# EasyEDA schematic SCH_SimpleFOC-StepMini_2024-05-25.json
TITLE: StepMini; REV: 1.0; Date: 2024-04-26; Sheet: 1/1; Drawn By: the.skuric; Company: SimpleFOC
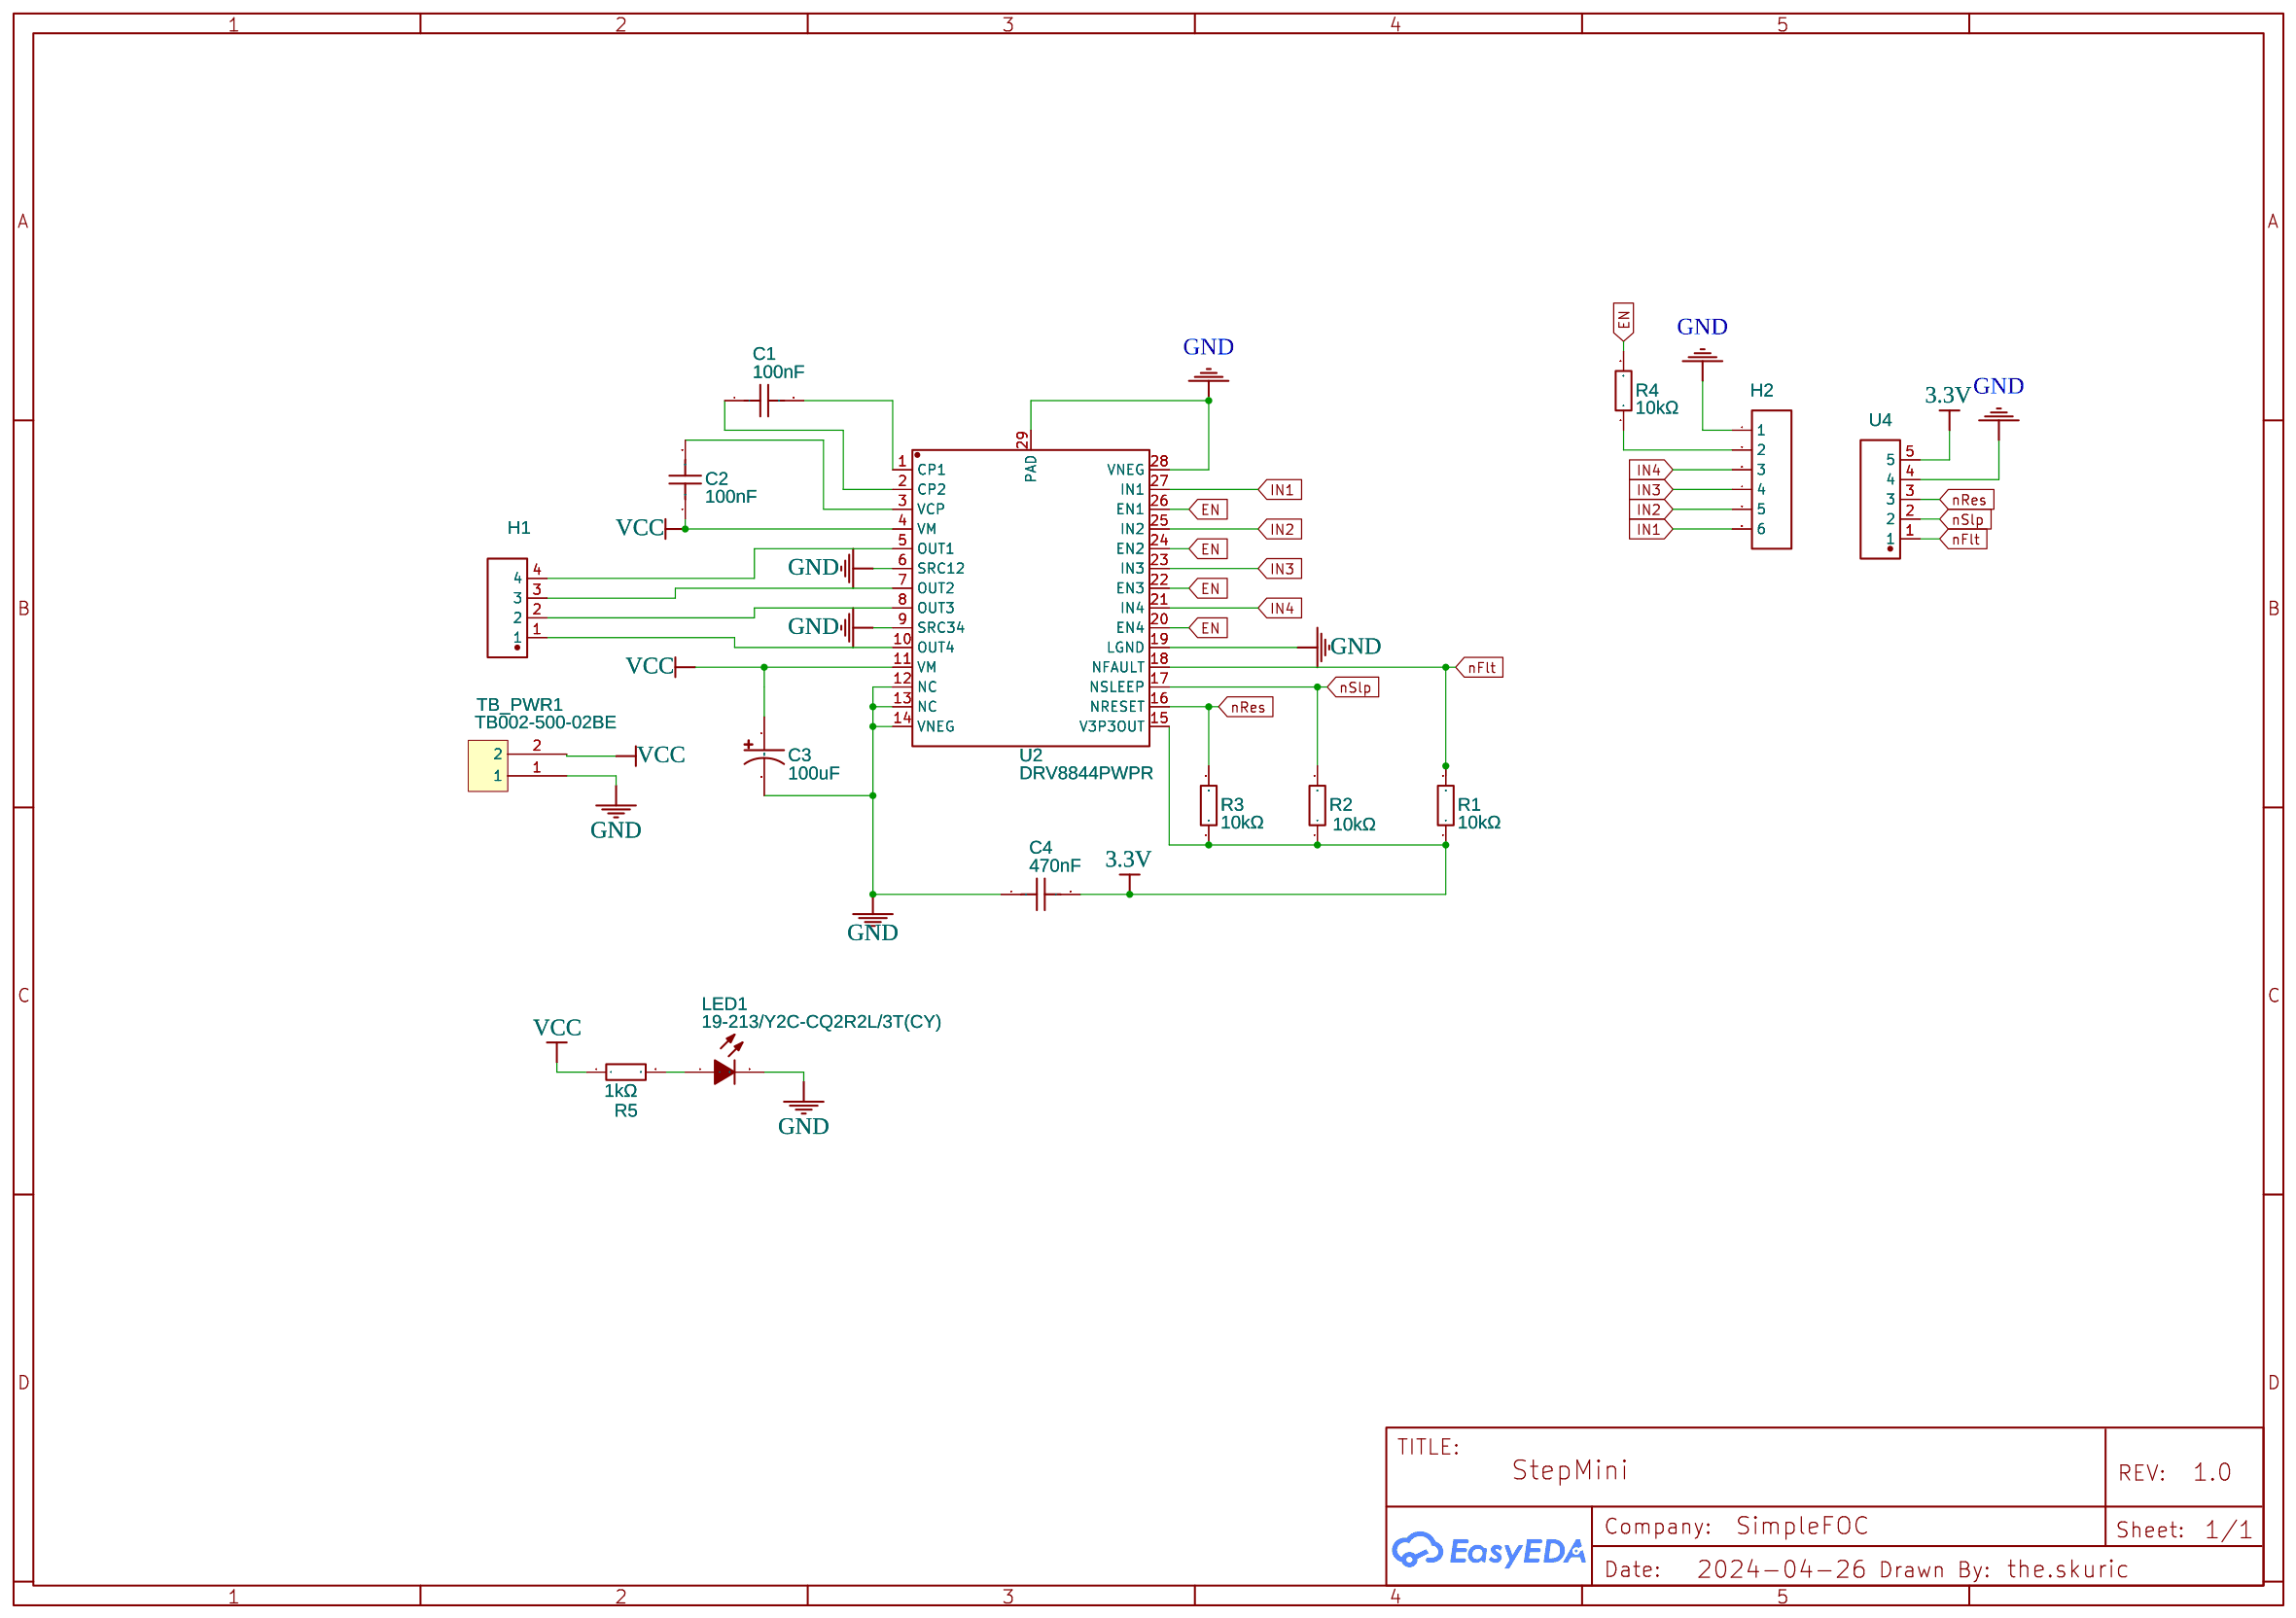
[diagram p0: schematic sheet]

## Parts
C1  100nF  [C0603]
C2  100nF  [C0603]
C3  100uF  [CAP-SMD_BD6.3-L6.6-W6.6-FD]
C4  470nF  [C0603]
H1  KH-2.54PH180-1X4P-L11.5  [HDR-TH_4P-P2.54-V-M]
H2  Header-Male-2.54_1x6  [HDR-TH_6P-P2.54-V-M-1]
LED1  19-213/Y2C-CQ2R2L/3T(CY)  [LED0603-R-RD]
R1  10kΩ  [R0603]
R2  10kΩ  [R0603]
R3  10kΩ  [R0603]
R4  10kΩ  [R0603]
R5  1kΩ  [R0603]
TB_PWR1  TB002-500-02BE  [TB002-500-02BE]
U2  DRV8844PWPR  [HTSSOP-28_L9.8-W4.5-P0.65-LS6.6-BL-EP]
U4  KH-2.54FH-1X5P-H8.5  [HDR-TH_5P-P2.54-V-F]

## Library data of the parts
C1 C2 = CL10B104KB8NNNC: Supplier: LCSC; Manufacturer: SAMSUNG; Supplier Part: C1591
C3 = VT1V101M-CRE77: Supplier: LCSC; Supplier Part: C294520; Manufacturer: Vertical Technology; Contributor: LCSC
C4 = CC0603ZRY5V6BB474: Supplier: LCSC; Supplier Part: C327269; Manufacturer: YAGEO; Contributor: LCSC
H1 = KH-2.54PH180-1X4P-L11.5: Contributor: LCSC; Supplier: LCSC; Supplier Part: C2905435; Manufacturer: kinghelm(金航标); JLCPCB Part Class: Extended Part
H2 = Header-Male-2.54_1x6: Supplier: LCSC; Manufacturer: BOOMELE(博穆精密); Manufacturer Part: 2.54-1x6P直针; Supplier Part: C37208; JLCPCB Part Class: Extended Part
LED1 = 19-213/Y2C-CQ2R2L/3T(CY): Supplier: LCSC; Manufacturer: EVERLIGHT; Supplier Part: C72038; JLCPCB Part Class: Basic Part
R1-R5 = 0603WAF4701T5E: Supplier: LCSC; Manufacturer: UniOhm; Supplier Part: C23162; Resistance (Ohms): 4.7K; JLCPCB Part Class: Basic Part
TB_PWR1 = TB002-500-02BE: Supplier 1: Mouser; Supplier Part Number 1: 490-TB002-500-02BE; Contributor: the.skuric
U2 = DRV8844PWPR: Contributor: LCSC; Supplier: LCSC; Supplier Part: C177807; Manufacturer: TI(德州仪器); JLCPCB Part Class: Extended Part
U4 = KH-2.54FH-1X5P-H8.5: Contributor: LCSC; Supplier: LCSC; Supplier Part: C2932671; Manufacturer: kinghelm(金航标)

## Nets
3.3V: C4.2 R1.1 R2.1 R3.1 U2.15(V3P3OUT) U4.5
GND: C3.2 C4.1 H2.1 LED1.2(C) TB_PWR1.1 U2.6(SRC12) U2.9(SRC34) U2.12(NC) U2.13(NC) U2.14(VNEG) U2.19(LGND) U2.28(VNEG) U2.29(PAD) U4.4
VCC: C2.1 C3.1 R5.1 TB_PWR1.2 U2.4(VM) U2.11(VM)
EN: R4.2 U2.20(EN4) U2.22(EN3) U2.24(EN2) U2.26(EN1)
IN1: H2.6 U2.27(IN1)
IN2: H2.5 U2.25(IN2)
IN3: H2.4 U2.23(IN3)
IN4: H2.3 U2.21(IN4)
nFlt: R1.2 U2.18(NFAULT) U4.1
nRes: R3.2 U2.16(NRESET) U4.3
nSlp: R2.2 U2.17(NSLEEP) U4.2
Net-(C1-1): C1.1 U2.2(CP2)
Net-(C1-2): C1.2 U2.1(CP1)
Net-(C2-2): C2.2 U2.3(VCP)
Net-(H1-1): H1.1 U2.10(OUT4)
Net-(H1-2): H1.2 U2.8(OUT3)
Net-(H1-3): H1.3 U2.7(OUT2)
Net-(H1-4): H1.4 U2.5(OUT1)
Net-(H2-2): H2.2 R4.1
Net-(LED1-1): LED1.1(A) R5.2
